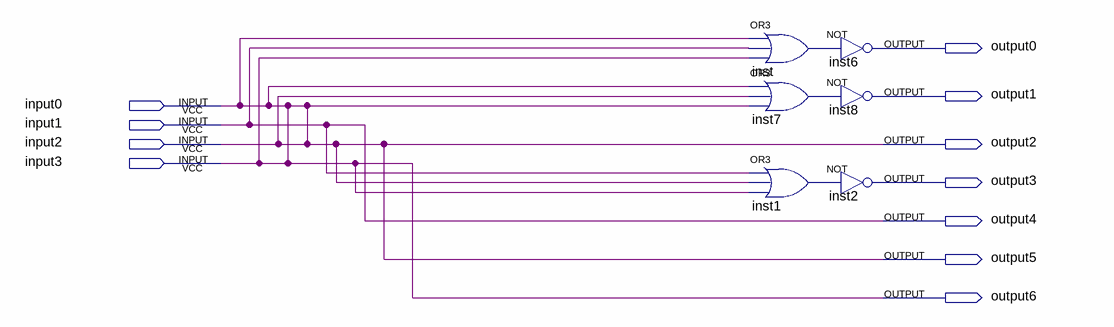
[diagram p0: schematic sheet]
// Quartus schematic coder.bdf as structural Verilog: 6 symbols, 11 pins
module coder (
  input  input0,
  input  input1,
  input  input2,
  input  input3,
  output output0,
  output output1,
  output output2,
  output output3,
  output output4,
  output output5,
  output output6
);

  wire inst1_out, inst7_out, inst_out;

  or inst (inst_out, input0, input1, input0);
  or inst7 (inst7_out, input0, input0, input0);
  or inst1 (inst1_out, input1, input0, input0);
  not inst6 (output0, inst_out);
  not inst8 (output1, inst7_out);
  not inst2 (output3, inst1_out);

  assign input2 = input0;
  assign input3 = input0;
  assign output2 = input0;
  assign output4 = input1;
  assign output5 = input0;
  assign output6 = input0;
endmodule
